# Altium project Sayma_AMC.PrjPcb (part 6 of 18)

## Sheet PWR_DC_DC_EXAR.SchDoc: Sayma AMC
size 420 x 297 mm; $$Internal___BlkDate: 0:12:25_2-9-18; $$Internal_NAME_PLACEHOLDER: a3sheet; $$Internal_Resolution: 00001mm; $$NotCommonProperty_@NAME: PWR_DC_DC_EXAR; $$NotCommonProperty_@PRINTORDER: 2; $$NotCommonProperty_@SHEET: 1; $$NotCommonProperty_@SHEETTOTAL: 1; CmpIndex: 9; Drawing Author: G.Kasprowicz; Drawing Number: Sayma AMC; Drawing Project: AMC FMC Carrier Board; Drawing Revision: 2.0; SymIndex: 2141; CheckedBy: P.Kulik,T.Przywozki,W.Ruclo; Author: G.Kasprowicz; CompanyName: WUT ISE; DrawnBy: G.Kasprowicz; Organization: WUT ISE; Address1: PW ISE; Address2: Nowowiejska 15/19 00-665 Warsaw; Address3: gkasprow@gmail.com; DocumentNumber: 14; Revision: 2; SheetNumber: 14; SheetTotal: 32; ModifiedBy: -; CheckedDate: -; Title2: Exar & 5V supply; DivGrp: WUT ISE; Designer: G.Kasprowicz; ModifiedDate: -; ProjectName: Sensor Box
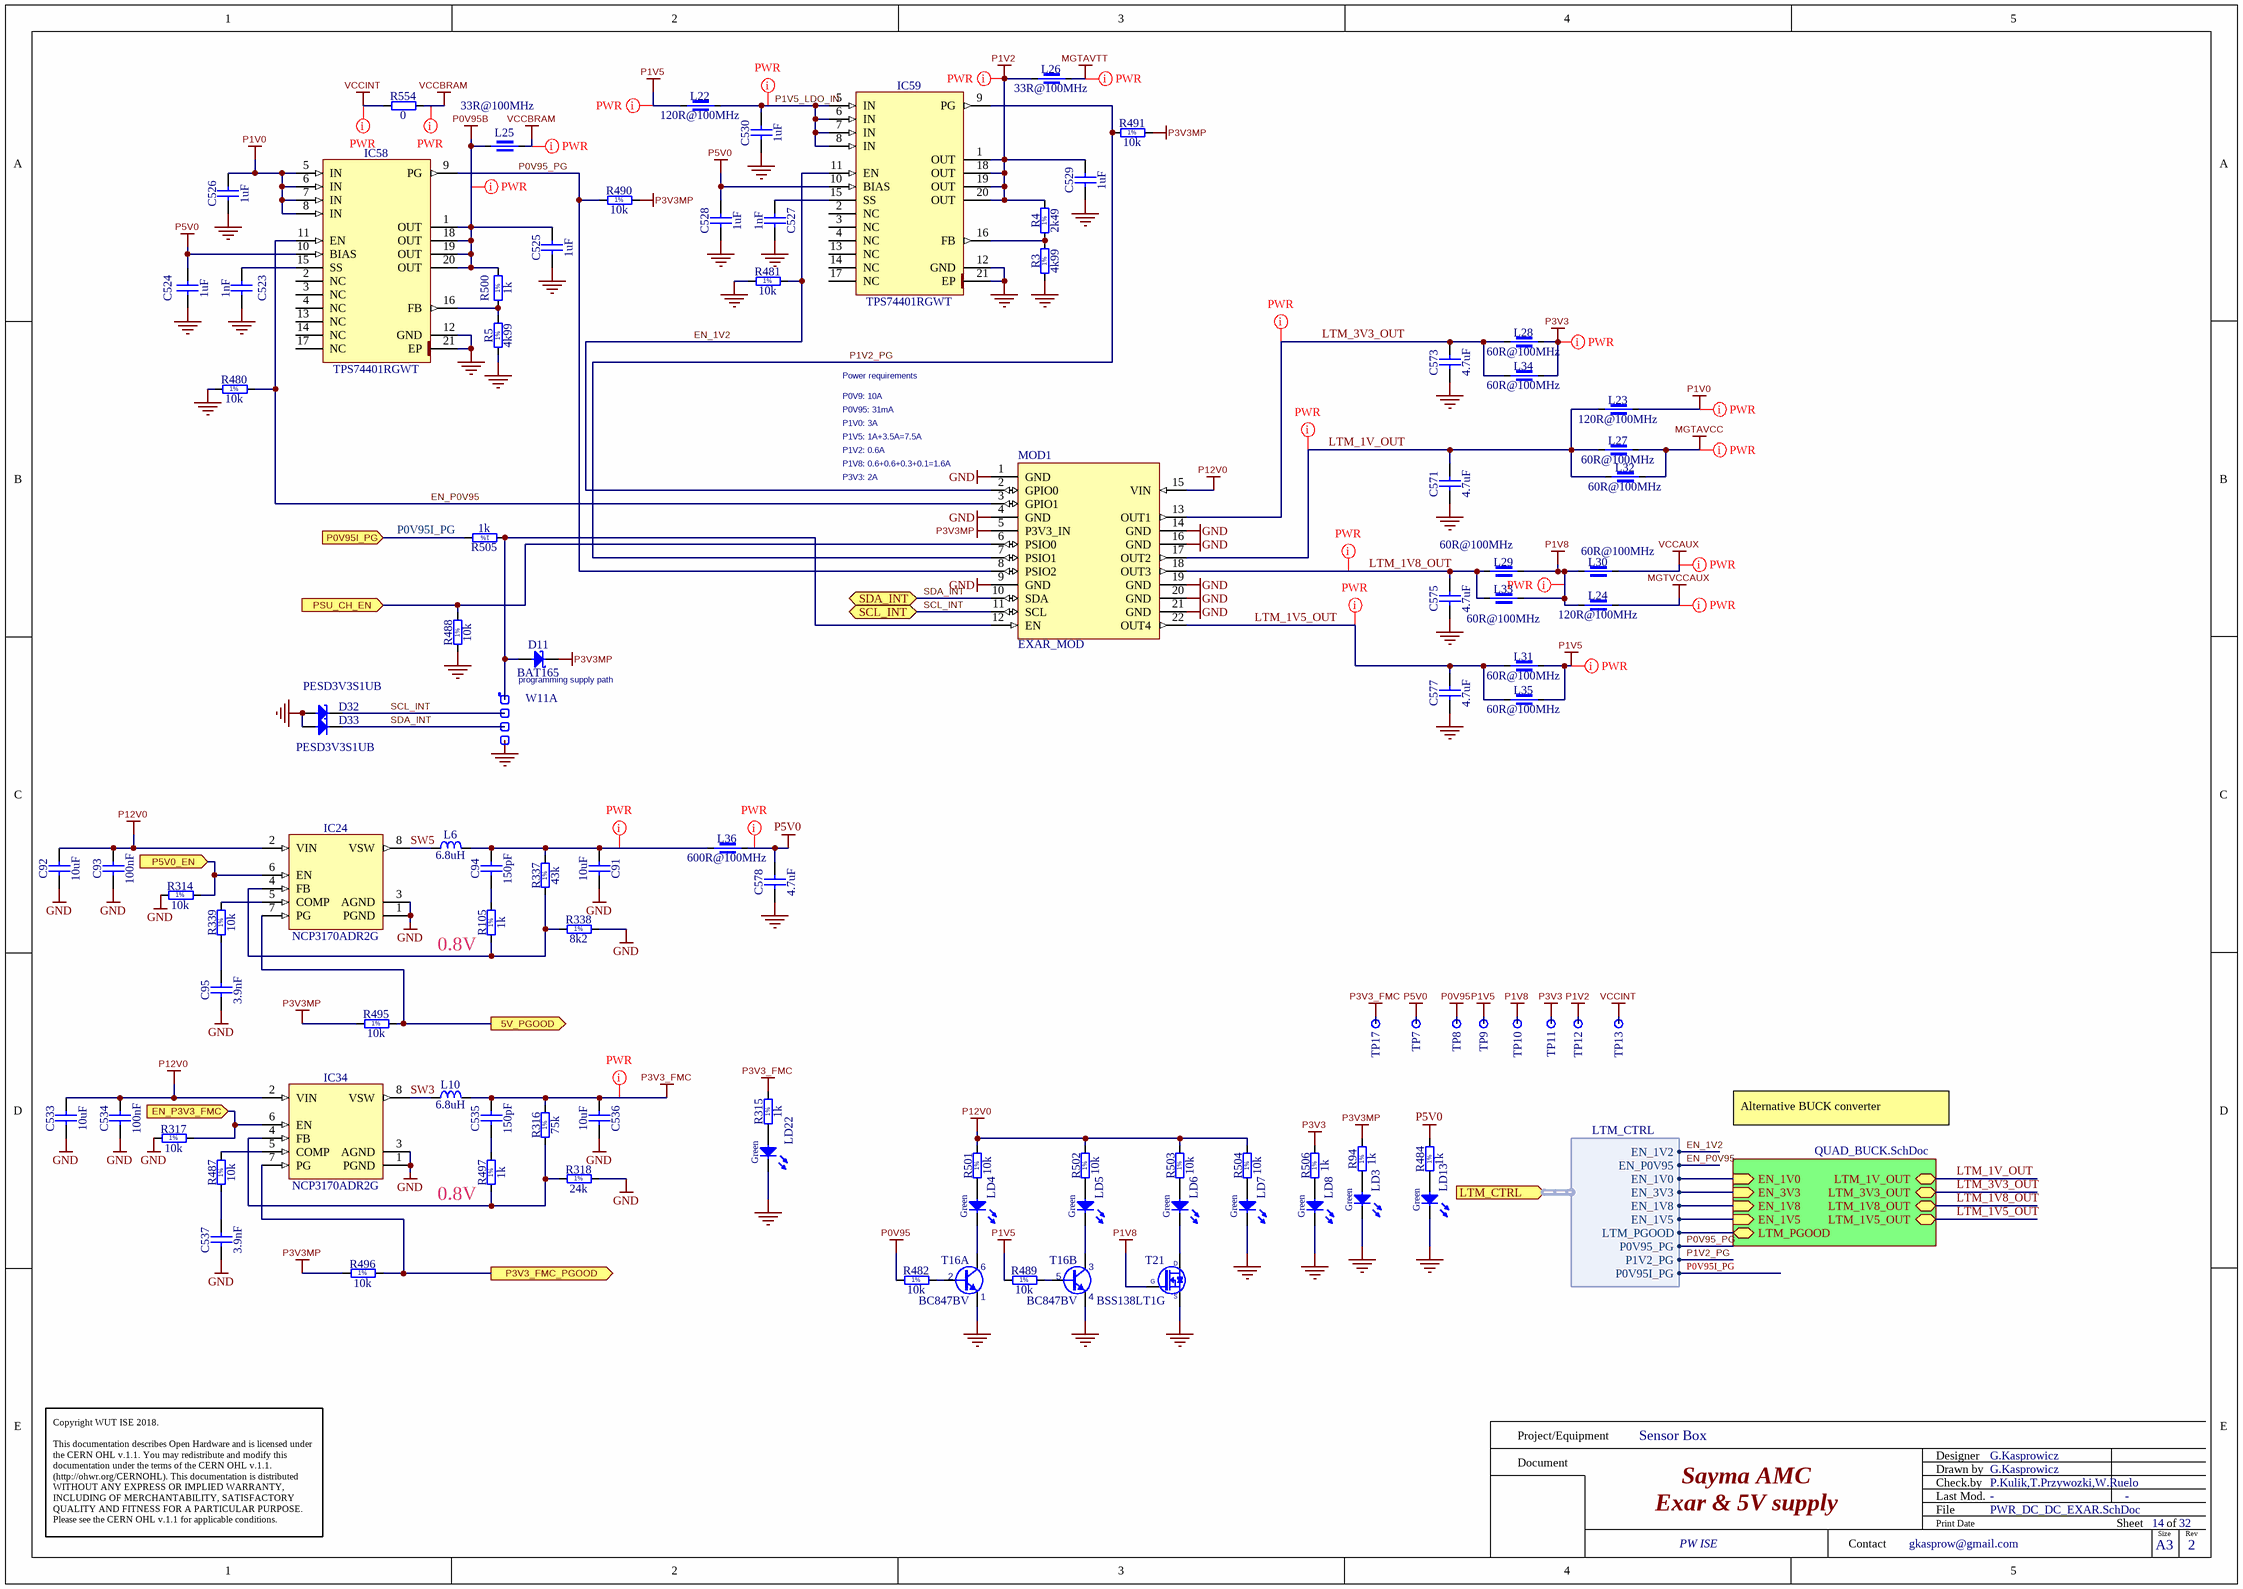
[diagram p8: PWR_DC_DC_EXAR.SchDoc]

### Parts
C91  10uF  [CAPC2012X135N]
C92  10uF  [CAPC2012X135N]
C93  100nF  [CAPC1005X55N]
C94  150pF  [CAPC1608X87N]
C95  3.9nF  [CAPC1608X87N]
C523  1nF  [CAPC1005X55N]
C524  1uF  [CAPC1005X55N]
C525  1uF  [CAPC1005X55N]
C526  1uF  [CAPC1005X55N]
C527  1nF  [CAPC1005X55N]
C528  1uF  [CAPC1005X55N]
C529  1uF  [CAPC1005X55N]
C530  1uF  [CAPC1005X55N]
C533  10uF  [CAPC2012X135N]
C534  100nF  [CAPC1005X55N]
C535  150pF  [CAPC1608X87N]
C536  10uF  [CAPC2012X135N]
C537  3.9nF  [CAPC1608X87N]
C571  4.7uF  [CAPC1709X95N]
C573  4.7uF  [CAPC1709X95N]
C575  4.7uF  [CAPC1709X95N]
C577  4.7uF  [CAPC1709X95N]
C578  4.7uF  [CAPC1709X95N]
D11  BAT165  [SOD2512X110N]
D32  PESD3V3S1UB  [SODFL1608X65N]
D33  PESD3V3S1UB  [SODFL1608X65N]
IC24  NCP3170ADR2G  [SOIC127P600X175-8N]
IC34  NCP3170ADR2G  [SOIC127P600X175-8N]
IC58  TPS74401RGWT  [QFN65P500X500X100-21N-S325]
IC59  TPS74401RGWT  [QFN65P500X500X100-21N-S325]
L6  6.8uH  [IND_BOURNS_SRU8043]
L10  6.8uH  [IND_BOURNS_SRU8043]
L22  120R@100MHz  [INDC1608X95N]
L23  120R@100MHz  [INDC1608X95N]
L24  120R@100MHz  [INDC1608X95N]
L25  33R@100MHz  [INDC1608X95N]
L26  33R@100MHz  [INDC1608X95N]
L27  60R@100MHz  [INDC4516X180N]
L28  60R@100MHz  [INDC4516X180N]
L29  60R@100MHz  [INDC4516X180N]
L30  60R@100MHz  [INDC4516X180N]
L31  60R@100MHz  [INDC4516X180N]
L32  60R@100MHz  [INDC4516X180N]
L33  60R@100MHz  [INDC4516X180N]
L34  60R@100MHz  [INDC4516X180N]
L35  60R@100MHz  [INDC4516X180N]
L36  600R@100MHz  [INDC2012X110N]
LD3  Green  [LED_KINGBRIGHT_KPH-1608CGCK]
LD4  Green  [LED_KINGBRIGHT_KPH-1608CGCK]
LD5  Green  [LED_KINGBRIGHT_KPH-1608CGCK]
LD6  Green  [LED_KINGBRIGHT_KPH-1608CGCK]
LD7  Green  [LED_KINGBRIGHT_KPH-1608CGCK]
LD8  Green  [LED_KINGBRIGHT_KPH-1608CGCK]
LD13  Green  [LED_KINGBRIGHT_KPH-1608CGCK]
LD22  Green  [LED_KINGBRIGHT_KPH-1608CGCK]
MOD1  EXAR_MOD  [EXAR_MOD]
R3  4k99  [RESC1608X55N]
R4  2k49  [RESC1608X55N]
R5  4k99  [RESC1608X55N]
R94  1k  [RESC1005X40N]
R105  1k  [RESC1005X40N]
R314  10k  [RESC1005X40N]
R315  1k  [RESC1005X40N]
R316  75k  [RESC1608X55N]
R317  10k  [RESC1005X40N]
R318  24k  [RESC1608X55N]
R337  43k  [RESC1608X55N]
R338  8k2  [RESC1608X55N]
R339  10k  [RESC1005X40N]
R480  10k  [RESC1005X40N]
R481  10k  [RESC1005X40N]
R482  10k  [RESC1005X40N]
R484  1k  [RESC1005X40N]
R487  10k  [RESC1005X40N]
R488  10k  [RESC1005X40N]
R489  10k  [RESC1005X40N]
R490  10k  [RESC1005X40N]
R491  10k  [RESC1005X40N]
R495  10k  [RESC1005X40N]
R496  10k  [RESC1005X40N]
R497  1k  [RESC1005X40N]
R500  1k  [RESC1005X40N]
R501  10k  [RESC1005X40N]
R502  10k  [RESC1005X40N]
R503  10k  [RESC1005X40N]
R504  10k  [RESC1005X40N]
R505  1k  [RESC1005X40N]
R506  1k  [RESC1005X40N]
R554  0  [RESC2012X60N]
T16  BC847BV  [SOTFL50P160X60-6N]  (parts A,B of 2)
T21  BSS138LT1G  [SOT95P240X110-3N]
TP7  Test Point  [TPS127]  (value not drawn)
TP8  Test Point  [TPS127]  (value not drawn)
TP9  Test Point  [TPS127]  (value not drawn)
TP10  Test Point  [TPS127]  (value not drawn)
TP11  Test Point  [TPS127]  (value not drawn)
TP12  Test Point  [TPS127]  (value not drawn)
TP13  Test Point  [TPS127]  (value not drawn)
TP17  Test Point  [TPS127]  (value not drawn)
W11  Header 4  [SAMTEC_MTLW-104-07-L-S-250]  (value not drawn)  (parts A,B,C,D of 4)

### Sub-sheets
U_QUAD_BUCK = QUAD_BUCK.SchDoc: LTM_1V_OUT (bidir), LTM_1V5_OUT (bidir), EN_1V0 (in), EN_1V5 (in), EN_3V3 (in), EN_1V8 (in), LTM_PGOOD (bidir), LTM_3V3_OUT (bidir), LTM_1V8_OUT (bidir)

### Ports
5V_PGOOD (out), EN_P3V3_FMC (in), LTM_CTRL (in, harness LTM_CTRL), P0V95I_PG (in), P3V3_FMC_PGOOD (out), P5V0_EN (in), PSU_CH_EN (in), SCL_INT (bidir), SDA_INT (bidir)

### Harnesses
LTM_CTRL: EN_1V0, EN_3V3, EN_1V8, EN_1V5, LTM_PGOOD, EN_1V2, EN_P0V95, P0V95_PG, P1V2_PG, P0V95I_PG

### Nets
GND: C91.2 C92.1 C93.1 C95.1 C523.2 C524.1 C525.1 C526.1 C527.2 C528.1 C529.1 C530.1 C533.1 C534.1 C536.2 C537.1 C571.1 C573.1 C575.1 C577.1 C578.1 D32.2(A) D33.2(A) IC24.1(PGND) IC24.3(AGND) IC34.1(PGND) IC34.3(AGND) IC58.12(GND) IC58.21(EP) IC59.12(GND) IC59.21(EP) LD3.1(C) LD7.1(C) LD8.1(C) LD13.1(C) LD22.1(C) MOD1.1(GND) MOD1.4(GND) MOD1.9(GND) MOD1.14(GND) MOD1.16(GND) MOD1.19(GND) MOD1.20(GND) MOD1.21(GND) R3.1 R5.1 R314.1 R317.1 R318.2 R338.2 R480.1 R481.1 R488.1 T16.1(E) T16.4(E) T21.2(S) W11.4
MGTAVCC: L27.2 L32.2
MGTAVTT: L26.2
MGTVCCAUX: L24.1
P0V95: R482.1 TP8.1
P0V95B: C525.2 IC58.1(OUT) IC58.18(OUT) IC58.19(OUT) IC58.20(OUT) L25.1 R500.2
P1V0: C526.2 IC58.5(IN) IC58.6(IN) IC58.7(IN) IC58.8(IN) L23.1
P1V2: C529.2 IC59.1(OUT) IC59.18(OUT) IC59.19(OUT) IC59.20(OUT) L26.1 R4.2 TP12.1
P1V5: L22.2 L31.2 L35.2 R489.1 TP9.1
P1V8: L24.2 L29.2 L30.1 L33.2 T21.1(G) TP10.1
P3V3: L28.2 L34.2 R506.2 TP11.1
P3V3_FMC: C535.2 C536.1 L10.2 R315.2 R316.2 TP17.1
P3V3MP: D11.1(C) MOD1.5(P3V3_IN) R94.2 R490.2 R491.2 R495.1 R496.1
P5V0: C524.2 C528.2 C578.2 IC58.10(BIAS) IC59.10(BIAS) L36.2 R484.2 TP7.1
P12V0: C92.2 C93.2 C533.2 C534.2 IC24.2(VIN) IC34.2(VIN) MOD1.15(VIN) R501.2 R502.2 R503.2 R504.2
VCCAUX: L30.2
VCCBRAM: L25.2 R554.2
VCCINT: R554.1 TP13.1
EN_1V0: sheet U_QUAD_BUCK/EN_1V0, port LTM_CTRL.EN_1V0
EN_1V2: IC59.11(EN) MOD1.2(GPIO0) R481.2 ; port LTM_CTRL.EN_1V2
EN_1V5: sheet U_QUAD_BUCK/EN_1V5, port LTM_CTRL.EN_1V5
EN_1V8: sheet U_QUAD_BUCK/EN_1V8, port LTM_CTRL.EN_1V8
EN_3V3: sheet U_QUAD_BUCK/EN_3V3, port LTM_CTRL.EN_3V3
EN_P0V95: IC58.11(EN) MOD1.3(GPIO1) R480.2 ; port LTM_CTRL.EN_P0V95
EN_P3V3_FMC: IC34.6(EN) R317.2 ; port EN_P3V3_FMC
EN_P5V0: IC24.6(EN) R314.2 ; port P5V0_EN
EN_PSU_CH: MOD1.6(PSIO0) R488.2 ; port PSU_CH_EN
LTM_1V5_OUT: C577.2 L31.1 L35.1 MOD1.22(OUT4) ; sheet U_QUAD_BUCK/LTM_1V5_OUT
LTM_1V8_OUT: C575.2 L29.1 L33.1 MOD1.18(OUT3) ; sheet U_QUAD_BUCK/LTM_1V8_OUT
LTM_1V_OUT: C571.2 L23.2 L27.1 L32.1 MOD1.17(OUT2) ; sheet U_QUAD_BUCK/LTM_1V_OUT
LTM_3V3_OUT: C573.2 L28.1 L34.1 MOD1.13(OUT1) ; sheet U_QUAD_BUCK/LTM_3V3_OUT
LTM_PGOOD: sheet U_QUAD_BUCK/LTM_PGOOD, port LTM_CTRL.LTM_PGOOD
P0V95_PG: IC58.9(PG) MOD1.8(PSIO2) R490.1 ; port LTM_CTRL.P0V95_PG
P0V95I_PG: R505.2 ; port P0V95I_PG, port LTM_CTRL.P0V95I_PG
P1V2_PG: IC59.9(PG) MOD1.7(PSIO1) R491.1 ; port LTM_CTRL.P1V2_PG
P1V5_LDO_IN: C530.2 IC59.5(IN) IC59.6(IN) IC59.7(IN) IC59.8(IN) L22.1
P3V3_FMC_PGOOD: IC34.7(PG) R496.2 ; port P3V3_FMC_PGOOD
PGOOD_P5V0: IC24.7(PG) R495.2 ; port 5V_PGOOD
SCL_INT: D32.1(C) MOD1.11(SCL) W11.2 ; port SCL_INT  [project net PM_SCL]
SDA_INT: D33.1(C) MOD1.10(SDA) W11.3 ; port SDA_INT  [project net PM_SDA]
SW3: IC34.8(VSW) L10.1
SW5: IC24.8(VSW) L6.1
NetC91_1: C91.1 C94.2 L6.2 L36.1 R337.2
NetC94_1: C94.1 R105.2
NetC95_2: C95.2 R339.1
NetC523_1: C523.1 IC58.15(SS)
NetC527_1: C527.1 IC59.15(SS)
NetC535_1: C535.1 R497.2
NetC537_2: C537.2 R487.1
NetD11_2: D11.2(A) MOD1.12(EN) R505.1 W11.1
NetIC24_4: IC24.4(FB) R105.1 R337.1 R338.1
NetIC24_5: IC24.5(COMP) R339.2
NetIC34_4: IC34.4(FB) R316.1 R318.1 R497.1
NetIC34_5: IC34.5(COMP) R487.2
NetIC58_16: IC58.16(FB) R5.2 R500.1
NetIC59_16: IC59.16(FB) R3.2 R4.1
NetLD3_2: LD3.2(A) R94.1
NetLD4_1: LD4.1(C) T16.6(C)
NetLD4_2: LD4.2(A) R501.1
NetLD5_1: LD5.1(C) T16.3(C)
NetLD5_2: LD5.2(A) R502.1
NetLD6_1: LD6.1(C) T21.3(D)
NetLD6_2: LD6.2(A) R503.1
NetLD7_2: LD7.2(A) R504.1
NetLD8_2: LD8.2(A) R506.1
NetLD13_2: LD13.2(A) R484.1
NetLD22_2: LD22.2(A) R315.1
NetR482_2: R482.2 T16.2(B)
NetR489_2: R489.2 T16.5(B)

Not connected (* = marked no-connect by the designer): IC58 2(NC) 3(NC) 4(NC) 13(NC) 14(NC) 17(NC); IC59 2(NC) 3(NC) 4(NC) 13(NC) 14(NC) 17(NC)

### Layout directives
net class PWR: LTM_1V5_OUT, LTM_1V8_OUT, LTM_1V_OUT, LTM_3V3_OUT, MGTAVCC, MGTAVTT, MGTVCCAUX, NetC91_1, P0V95B, P1V0, P1V2, P1V5, P1V5_LDO_IN, P1V8, P3V3, P3V3_FMC, P5V0, VCCAUX, VCCBRAM, VCCINT

### Notes on the sheet
- Power requirements
- P0V9: 10A
- P1V0: 3A
- P0V95: 31mA
- P1V5: 1A+3.5A=7.5A
- P1V2: 0.6A
- P3V3: 2A
- P1V8: 0.6+0.6+0.3+0.1=1.6A
- programming supply path
- (near R105) 0.8V
- Alternative BUCK converter
- (near R497) 0.8V
- Project/Equipment
- Document
- Designer
- Drawn by
- Check.by
- Copyright WUT ISE 2018.
  This documentation describes Open Hardware and is licensed under the CERN OHL v.1.1. You may redistribute and modify this documentation under the terms of the CERN OHL v.1.1. (http://ohwr.org/CERNOHL). This documentation is distributed WITHOUT ANY EXPRESS OR IMPLIED WARRANTY, INCLUDING OF MERCHANTABILITY, SATISFACTORY QUALITY AND FITNESS FOR A PARTICULAR PURPOSE. Please see the CERN OHL v.1.1 for applicable conditions.
- Contact
- File
- Last Mod.
- Print Date
- Sheet
- Size
- A3
- of
- Rev
- (in symbol R0402_1K_1%_0.0625W_100PPM) 1%
- (in symbol R0402_10K_1%_0.0625W_100PPM) 1%
- (in symbol R0603_2K49_1%_0.063W_50PPM) 1%
- (in symbol R0603_4K99_1%_0.063W_50PPM) 1%
- (in symbol R0603_8K2_1%_0.1W_100PPM) 1%
- (in symbol R0603_24k_1%_0.1W_100PPM) 1%
- (in symbol R0603_43K_1%_0.1W_100PPM) 1%
- (in symbol R0603_75K_1%_0.1W_100PPM) 1%

### Library data of the parts
C91 C92 C533 C536 = CC0805_10UF_16V_10%_X5R: Non-polarised capacitor; Part Description: SMD Multilayer Chip Ceramic Capacitor; Manufacturer: GENERIC; Manufacturer1 Part Number: C0805C106K4PAC; Voltage: 16V; TC: X5R; Tolerance: ±10%; Part Number: CC0805_10UF_16V_10%_X5R; Component Kind: Standard; Component Type: Standard; Pin Count: 2; Value: 10uF; Status: Preferred; Manufacturer Part Number: CC0805_10UF_16V_10%_X5R; Case: 0805; Mounted: Yes; Socket: No; SMD: Yes; Manufacturer1 Example: KEMET; Manufacturer1 ComponentHeight: 1.4mm; HelpURL: \\cern.ch\dfs\Applications\Altium\Datasheets\CC1206_X5R_KEMET.pdf; Author: CERN DEM JLC; CreateDate: 03.12.2007; LatestRevisionDate: 03.12.2007; Sense: No
C93 C534 = CC0402_100NF_16V_10%_X5R: Non-polarised capacitor; Part Description: SMD Multilayer Chip Ceramic Capacitor; Manufacturer: GENERIC; Manufacturer1 Part Number: GRM155R61C104KA88D; Voltage: 16V; TC: X5R; Tolerance: ±10%; Part Number: CC0402_100NF_16V_10%_X5R; Component Kind: Standard; Component Type: Standard; Pin Count: 2; Value: 100nF; Status: None; Manufacturer Part Number: CC0402_100NF_16V_10%_X5R; Case: 0402; Mounted: Yes; Socket: No; SMD: Yes; Sense: No; Manufacturer1 Example: MURATA; Manufacturer1 ComponentHeight: 0.55mm; HelpURL: \\cern.ch\dfs\Applications\Altium\Datasheets\CC0402_X5R_MURATA_GRM.pdf; Author: CERN DEM JLC; CreateDate: 10.12.2013; LatestRevisionDate: 10.12.2013
C94 C535 = CC0603_150PF_50V_1%_NP0: Non-polarised capacitor; Part Description: SMD Multilayer Chip Ceramic Capacitor; Manufacturer: GENERIC; Manufacturer1 Part Number: CC0603FRNPO9BN151; Voltage: 50V; TC: C0G/NP0; Tolerance: ±1%; Part Number: CC0603_150PF_50V_1%_NP0; Component Kind: Standard; Component Type: Standard; Pin Count: 2; Value: 150pF; Status: None; Manufacturer Part Number: CC0603_150PF_50V_1%_NP0; Case: 0603; Mounted: Yes; Socket: No; SMD: Yes; Sense: No; Manufacturer1 Example: PHYCOMP; Manufacturer1 ComponentHeight: 0.7mm; HelpURL: \\cern.ch\dfs\Applications\Altium\Datasheets\CC0805_NP0_PHYCOMP_16VTO50V.pdf; Author: CERN DEM MR; CreateDate: 17.02.2016; LatestRevisionDate: 17.02.2016
C95 C537 = CC0603_3.9NF_50V_5%_X7R: Non-polarised capacitor; Part Description: SMD Multilayer Chip Ceramic Capacitor; Manufacturer: GENERIC; Manufacturer1 Part Number: 223858615631; Voltage: 50V; TC: X7R; Tolerance: ±5%; Part Number: CC0603_3.9NF_50V_5%_X7R; Component Kind: Standard; Component Type: Standard; Pin Count: 2; Value: 3.9nF; Status: Preferred; Manufacturer Part Number: CC0603_3.9NF_50V_5%_X7R; Case: 0603; Mounted: Yes; Socket: No; SMD: Yes; Sense: No; Manufacturer1 Example: PHYCOMP; Manufacturer1 ComponentHeight: 0.87mm; HelpURL: \\cern.ch\dfs\Applications\Altium\Datasheets\CC0603_X7R_PHYCOMP.pdf; Author: CERN DEM JLC; CreateDate: 03.12.2007; LatestRevisionDate: 03.12.2007
C523 C527 = CC0402_1NF_50V_10%_X7R: Non-polarised capacitor; Manufacturer: GENERIC; Part Description: SMD Multilayer Chip Ceramic Capacitor; Manufacturer1 Part Number: 223858715623; Tolerance: ±10%; Voltage: 50V; TC: X7R; Manufacturer Part Number: CC0402_1NF_50V_10%_X7R; Part Number: CC0402_1NF_50V_10%_X7R; Value: 1nF; Component Kind: Standard; Component Type: Standard; Pin Count: 2; Status: Not Recommended; Case: 0402; Mounted: Yes; Socket: No; SMD: Yes; Sense: No; Manufacturer1 Example: PHYCOMP; Manufacturer1 ComponentHeight: 0.55mm; HelpURL: \\cern.ch\dfs\Applications\Altium\Datasheets\CC0402_X7R_PHYCOMP.pdf; Author: CERN DEM JLC; CreateDate: 03.12.2007; LatestRevisionDate: 03.12.2007
C524-C526 C528-C530 = CC0402_1UF_16V_10%_X5R: as C439-C445 on sheet SDRAM_DDR3_2x16; Manufacturer Part Number: CC0402_1UF_16V_10%_X5R; Part Number: CC0402_1UF_16V_10%_X5R; Value: 1uF; Component Kind: Standard; Component Type: Standard; Pin Count: 2; Status: Preferred; Case: 0402; Mounted: Yes; Socket: No; SMD: Yes; Sense: No; Manufacturer1 Example: TDK; Manufacturer1 ComponentHeight: 0.55mm; HelpURL: \\cern.ch\dfs\Applications\Altium\Datasheets\CC0402_X5R_TDK_C.pdf; Author: CERN DEM JLC; CreateDate: 25.10.2012; LatestRevisionDate: 25.10.2012
C571 C573 C575 C577 C578 = CC0603_4.7UF_16V_10%_X5R: as C564 on sheet POWER_Management; Manufacturer Part Number: CC0603_4.7UF_16V_10%_X5R; Part Number: CC0603_4.7UF_16V_10%_X5R; Value: 4.7uF; Component Kind: Standard; Component Type: Standard; Pin Count: 2; Status: None; Case: 0603; Mounted: Yes; Socket: No; SMD: Yes; Sense: No; Manufacturer1 Example: TAIYO YUDEN; Manufacturer1 ComponentHeight: 0.95mm; HelpURL: \\cern.ch\dfs\Applications\Altium\Datasheets\CC0603_X7R_TAIYO-YUDEN_HIGH-VALUE.pdf; Author: CERN DEM JLC; CreateDate: 16.12.2013; LatestRevisionDate: 16.09.2014
D11 = BAT165: as D8 on sheet POWER_Management; Manufacturer Part Number: BAT165; PackageDescription: Small Outline Diode (SOD-323), 1.70mm W X 1.25mm L X 1.10mm H body,  IPC Medium Density; Part Number: BAT165; Component Kind: Standard; Component Type: Standard; Device: BAT165; Pin Count: 2; Case: SOD323; Mounted: Yes; Socket: No; SMD: Yes; Sense: No; ComponentHeight: 1.1mm; HelpURL: \\cern.ch\dfs\Applications\Altium\Datasheets\BAT165.pdf; Author: CERN DEM JLC; CreateDate: 12.11.2014; LatestRevisionDate: 12.11.2014
D32 D33 = PESD3V3S1UB: ESD protection diode; Manufacturer: NXP SEMICONDUCTORS; Part Description: ESD protection diode (23kV); Voltage: 3V3; Power: 330W; PressFit: No; Bonding: No; Manufacturer Part Number: PESD3V3S1UB; PackageDescription: Ultra Small Outline Diode Flat Lead (SOD-523), Body; 1.2mm L X 0.8mm W X 0.65mm H, IPC Medium Density; Part Number: PESD3V3S1UB; Component Kind: Standard; Component Type: Standard; Device: PESD3V3S1UB; Pin Count: 2; Case: SOD523; Mounted: Yes; Socket: No; SMD: Yes; Sense: No; ComponentHeight: 0.65mm; HelpURL: \\cern.ch\dfs\Applications\Altium\Datasheets\PESD3V3S1UB.pdf; Author: CERN DEM JLC; CreateDate: 29.11.2012; LatestRevisionDate: 29.11.2012
IC24 IC34 = NCP3170ADR2G: Synchronous PWM Switching Converter; Manufacturer: ON SEMICONDUCTOR; PressFit: No; Bonding: No; Part Number: NCP3170ADR2G; Component Kind: Standard; Component Type: Standard; Device: NCP3170ADR2G; PackageDescription: SOIC 8, Pitch 1.27mm - Body 4x5mm, IPC Medium Density; Part Description: Synchronous PWM Switching Converter; Manufacturer Part Number: NCP3170ADR2G; Pin Count: 8; Case: SOIC8; Mounted: Yes; Socket: No; SMD: Yes; Sense: No; ComponentHeight: 1.75mm; Author: CERN DEM MR; HelpURL: \\cern.ch\dfs\Applications\Altium\Datasheets\NCP3170ADR2G.pdf; CreateDate: 30.05.2016; LatestRevisionDate: 30.05.2016
IC58 IC59 = TPS74401RGWT: Single Output LDO, 3.0A, Adj.(0.8 to 3.3V), Fast Transient Response, Programmable SoftStart; Manufacturer: TEXAS INSTRUMENTS; PressFit: No; Bonding: No; Manufacturer Part Number: TPS74401RGWT; PackageDescription: QFN, 0.65mm pitch,square; 20 pin, 5mm X 5mm X 1mm H body (w/thermal tab 3.25 X 3.25mm),  IPC Medium Density; Part Description: Single Output LDO, 3.0A, Adj.(0.8 to 3.3V), Fast Transient Response, Programmable SoftStart; Part Number: TPS74401RGWT; Component Kind: Standard; Component Type: Standard; Device: TPS74401RGWT; Pin Count: 21; Case: QFN20; Mounted: Yes; Socket: No; SMD: Yes; Sense: No; ComponentHeight: 1mm; HelpURL: \\cern.ch\dfs\Applications\Altium\Datasheets\TPS74401RGWT.pdf; Author: CERN DEM JLC; CreateDate: 02.02.2010; LatestRevisionDate: 02.02.2010
L6 L10 = IND_6.8UH_30%_BOURNS_SRU8043: Inductor; Part Description: Shielded SMD Power Inductor; Manufacturer: BOURNS; Manufacturer Part Number: SRU8043-6R8Y; Power: 3.8A; Resistance: 0.0224R; Tolerance: ±30%; Part Number: IND_6.8UH_30%_BOURNS_SRU8043; Component Kind: Standard; Component Type: Standard; Pin Count: 2; Value: 6.8uH; Status: None; Mounted: Yes; Socket: No; SMD: Yes; Sense: No; ComponentHeight: 4.6mm; HelpURL: \\cern.ch\dfs\Applications\Altium\Datasheets\IND_BOURNS_SRU8043.pdf; Author: CERN DEM JMW; CreateDate: 06.08.2015; LatestRevisionDate: 06.08.2015
L22-L24 = IND0603_MURATA_BLM18PG121SN1D: Manufacturer: MURATA; Part Description: SMD EMIFIL Chip Ferrite Bead; Power: 2A; Resistance: 0.05R; Manufacturer Part Number: BLM18PG121SN1D; Part Number: IND0603_MURATA_BLM18PG121SN1D; Value: 120R@100MHz; Component Kind: Standard; Component Type: Standard; Pin Count: 2; Status: None; Case: 0603; Mounted: Yes; Socket: No; SMD: Yes; Sense: No; ComponentHeight: 0.95mm; HelpURL: \\cern.ch\dfs\Applications\Altium\Datasheets\IND0603_MURATA_BLM18P.pdf; Author: CERN DEM BC; CreateDate: 27.07.2015; LatestRevisionDate: 25.10.2018
L25 L26 = IND0603_MURATA_BLM18PG330SN1D: Manufacturer: MURATA; Part Description: SMD EMIFIL Chip Ferrite Bead; Tolerance: ±25%; Power: 3A; Resistance: 0.025R; Manufacturer Part Number: BLM18PG330SN1D; Part Number: IND0603_MURATA_BLM18PG330SN1D; Value: 33R@100MHz; Component Kind: Standard; Component Type: Standard; Pin Count: 2; Status: None; Case: 0603; Mounted: Yes; Socket: No; SMD: Yes; Sense: No; ComponentHeight: 0.95mm; HelpURL: \\cern.ch\dfs\Applications\Altium\Datasheets\IND0603_MURATA_BLM18P.pdf; Author: CERN DEM JMW; CreateDate: 19.02.2014; LatestRevisionDate: 25.10.2018
L27-L35 = IND1806_MURATA_BLM41PG600SN1L: Manufacturer: MURATA; Part Description: SMD EMI Suppression Chip Ferrite Bead (BLM41P Series); Power: 6A; Resistance: 0.01R; Manufacturer Part Number: BLM41PG600SN1L; Part Number: IND1806_MURATA_BLM41PG600SN1L; Value: 60R@100MHz; Component Kind: Standard; Component Type: Standard; Pin Count: 2; Status: None; Case: 1806; Mounted: Yes; Socket: No; SMD: Yes; Sense: No; ComponentHeight: 1.8mm; HelpURL: \\cern.ch\dfs\Applications\Altium\Datasheets\IND1806_MURATA_BLM41P.pdf; Author: CERN DEM JLC; CreateDate: 02.12.2009; LatestRevisionDate: 02.12.2009
L36 = IND0805_WURTH_742792040: Manufacturer: WURTH ELEKTRONIK; Part Description: SMD EMI Suppression Chip Ferrite Bead (WE-CBF Series); Tolerance: ±25%; Power: 2A; Resistance: 0.150R; Manufacturer Part Number: 742792040; Part Number: IND0805_WURTH_742792040; Value: 600R@100MHz; Component Kind: Standard; Component Type: Standard; Pin Count: 2; Status: None; Case: 0805; Mounted: Yes; Socket: No; SMD: Yes; Sense: No; ComponentHeight: 1.1mm; HelpURL: \\cern.ch\dfs\Applications\Altium\Datasheets\IND0805_WURTH_742792040.pdf; Author: CERN DEM JLC; CreateDate: 10.05.2010; LatestRevisionDate: 25.10.2018
LD3-LD8 LD13 LD22 = LED_KINGBRIGHT_KPH-1608CGCK: as LD1 on sheet POWER_Management; Manufacturer Part Number: KPH-1608CGCK; Manufacturer: KINGBRIGHT; PackageDescription: SMT Green LED, Case 0603, Body L 1.6 x W 0.8mm H 0.65mm; Part Number: LED_KINGBRIGHT_KPH-1608CGCK; Component Kind: Standard; Component Type: Standard; Color: Green; Pin Count: 2; Mounted: Yes; Socket: No; SMD: Yes; Sense: No; ComponentHeight: 0.65mm; HelpURL: \\cern.ch\dfs\Applications\Altium\Datasheets\LED_KINGBRIGHT_KPH-1608CGCK.pdf; Author: CERN DEM JLC; CreateDate: 03.07.2017; LatestRevisionDate: 03.07.2017
MOD1 = DC/DC_EXAR_MOD: 4 channel PCB module based on XRP7724ILB-F
R3 R5 = R0603_4K99_1%_0.063W_50PPM: Resistor - 1%; Manufacturer: GENERIC; Part Description: General Purpose Thick Film Chip Resistor; Manufacturer1 Part Number: CPF0603F4K99C1; Power: 0.1W; TC: ±50ppm/°C; PressFit: No; Manufacturer Part Number: R0603_4K99_1%_0.063W_50PPM; Part Number: R0603_4K99_1%_0.063W_50PPM; Tolerance: ±1%; Value: 4k99; Component Kind: Standard; Component Type: Standard; Pin Count: 2; Status: None; Case: 0603; Mounted: Yes; Sense: No; Socket: No; SMD: Yes; Manufacturer1 Example: TYCO NEOHM; Manufacturer1 ComponentHeight: 0.55mm; HelpURL: \\cern.ch\dfs\Applications\Altium\Datasheets\R0603_TYCO_CPF.pdf; Author: CERN DEM JLC; CreateDate: 20.05.2010; LatestRevisionDate: 20.05.2010
R4 = R0603_2K49_1%_0.063W_50PPM: Resistor - 1%; Manufacturer: GENERIC; Part Description: General Purpose Thick Film Chip Resistor; Manufacturer1 Part Number: CPF0603F2K49C1; Power: 0.1W; TC: ±50ppm/°C; PressFit: No; Manufacturer Part Number: R0603_2K49_1%_0.063W_50PPM; Part Number: R0603_2K49_1%_0.063W_50PPM; Tolerance: ±1%; Value: 2k49; Component Kind: Standard; Component Type: Standard; Pin Count: 2; Status: None; Case: 0603; Mounted: Yes; Sense: No; Socket: No; SMD: Yes; Manufacturer1 Example: TYCO NEOHM; Manufacturer1 ComponentHeight: 0.55mm; HelpURL: \\cern.ch\dfs\Applications\Altium\Datasheets\R0603_TYCO_CPF.pdf; Author: CERN DEM JLC; CreateDate: 20.05.2010; LatestRevisionDate: 20.05.2010
R94 R315 R484 R500 R505 R506 = R0402_1K_1%_0.0625W_100PPM: as R83 on sheet POWER_Management; Manufacturer Part Number: R0402_1K_1%_0.0625W_100PPM; Part Number: R0402_1K_1%_0.0625W_100PPM; Tolerance: ±1%; Value: 1k; Component Kind: Standard; Component Type: Standard; Pin Count: 2; Status: Not Recommended; Power: 0.0625W; Case: 0402; Mounted: Yes; Sense: No; Socket: No; SMD: Yes; Manufacturer1 Example: YAGEO PHYCOMP; Manufacturer1 ComponentHeight: 0.4mm; HelpURL: \\cern.ch\dfs\Applications\Altium\Datasheets\R0402_Phycomp_RC0402.pdf; Author: CERN DEM JLC; CreateDate: 03.12.2007; LatestRevisionDate: 17.10.2012
R105 R497 = R0402_1K_1%_0.0625W_100PPM: Resistor - 1%; Part Description: General Purpose Thick Film Chip Resistor; Manufacturer: GENERIC; Manufacturer1 Part Number: 232270671002L; TC: ±100ppm/°C; PressFit: No; Part Number: R0402_1K_1%_0.0625W_100PPM; Component Kind: Standard; Component Type: Standard; Pin Count: 2; Value: 1k; Status: Not Recommended; Power: 0.0625W; Tolerance: ±1%; Manufacturer Part Number: R0402_1K_1%_0.0625W_100PPM; Case: 0402; Mounted: Yes; Sense: No; Socket: No; SMD: Yes; Manufacturer1 Example: YAGEO PHYCOMP; Manufacturer1 ComponentHeight: 0.4mm; HelpURL: \\cern.ch\dfs\Applications\Altium\Datasheets\R0402_Phycomp_RC0402.pdf; Author: CERN DEM JLC; CreateDate: 03.12.2007; LatestRevisionDate: 17.10.2012
R314 R317 R480-R482 R488-R491 R495 R496 R501-R504 = R0402_10K_1%_0.0625W_100PPM: as R139 on sheet SDRAM_DDR3_2x16; Manufacturer Part Number: R0402_10K_1%_0.0625W_100PPM; Part Number: R0402_10K_1%_0.0625W_100PPM; Tolerance: ±1%; Value: 10k; Component Kind: Standard; Component Type: Standard; Pin Count: 2; Status: Not Recommended; Power: 0.0625W; Case: 0402; Mounted: Yes; Sense: No; Socket: No; SMD: Yes; Manufacturer1 Example: YAGEO PHYCOMP; Manufacturer1 ComponentHeight: 0.4mm; HelpURL: \\cern.ch\dfs\Applications\Altium\Datasheets\R0402_Phycomp_RC0402.pdf; Author: CERN DEM JLC; CreateDate: 03.12.2007; LatestRevisionDate: 17.10.2012
R316 = R0603_75K_1%_0.1W_100PPM: Resistor - 1%; Part Description: General Purpose Thick Film Chip Resistor; Manufacturer: GENERIC; Manufacturer1 Part Number: NRC06F7502TRF; Power: 0.1W; TC: ±100ppm/°C; PressFit: No; Part Number: R0603_75K_1%_0.1W_100PPM; Component Kind: Standard; Component Type: Standard; Pin Count: 2; Value: 75k; Status: Preferred; Tolerance: ±1%; Manufacturer Part Number: R0603_75K_1%_0.1W_100PPM; Case: 0603; Mounted: Yes; Sense: No; Socket: No; SMD: Yes; Manufacturer1 Example: NIC COMPONENT; Manufacturer1 ComponentHeight: 0.55mm; HelpURL: \\cern.ch\dfs\Applications\Altium\Datasheets\R0603_NIC_NRC.pdf; Author: CERN DEM JLC; CreateDate: 03.12.2007; LatestRevisionDate: 13.03.2008
R318 = R0603_24k_1%_0.1W_100PPM: Resistor - 1%; Part Description: General Purpose Thick Film Chip Resistor; Manufacturer: GENERIC; Manufacturer1 Part Number: NRC06F2402TRF; Power: 0.1W; TC: ±100ppm/°C; PressFit: No; Part Number: R0603_24K_1%_0.1W_100PPM; Component Kind: Standard; Component Type: Standard; Pin Count: 2; Value: 24k; Status: Preferred; Tolerance: ±1%; Manufacturer Part Number: R0603_24K_1%_0.1W_100PPM; Case: 0603; Mounted: Yes; Sense: No; Socket: No; SMD: Yes; Manufacturer1 Example: NIC COMPONENT; Manufacturer1 ComponentHeight: 0.55mm; HelpURL: \\cern.ch\dfs\Applications\Altium\Datasheets\R0603_NIC_NRC.pdf; Author: CERN DEM JLC; CreateDate: 03.12.2007; LatestRevisionDate: 13.03.2008
R337 = R0603_43K_1%_0.1W_100PPM: Resistor - 1%; Part Description: General Purpose Thick Film Chip Resistor; Manufacturer: GENERIC; Manufacturer1 Part Number: NRC06F4302TRF; Power: 0.1W; TC: ±100ppm/°C; PressFit: No; Part Number: R0603_43K_1%_0.1W_100PPM; Component Kind: Standard; Component Type: Standard; Pin Count: 2; Value: 43k; Status: Preferred; Tolerance: ±1%; Manufacturer Part Number: R0603_43K_1%_0.1W_100PPM; Case: 0603; Mounted: Yes; Sense: No; Socket: No; SMD: Yes; Manufacturer1 Example: NIC COMPONENT; Manufacturer1 ComponentHeight: 0.55mm; HelpURL: \\cern.ch\dfs\Applications\Altium\Datasheets\R0603_NIC_NRC.pdf; Author: CERN DEM JLC; CreateDate: 03.12.2007; LatestRevisionDate: 13.03.2008
R338 = R0603_8K2_1%_0.1W_100PPM: Resistor - 1%; Part Description: General Purpose Thick Film Chip Resistor; Manufacturer: GENERIC; Manufacturer1 Part Number: NRC06F8201TRF; Power: 0.1W; TC: ±100ppm/°C; PressFit: No; Part Number: R0603_8K2_1%_0.1W_100PPM; Component Kind: Standard; Component Type: Standard; Pin Count: 2; Value: 8k2; Status: Preferred; Tolerance: ±1%; Manufacturer Part Number: R0603_8K2_1%_0.1W_100PPM; Case: 0603; Mounted: Yes; Sense: No; Socket: No; SMD: Yes; Manufacturer1 Example: NIC COMPONENT; Manufacturer1 ComponentHeight: 0.55mm; HelpURL: \\cern.ch\dfs\Applications\Altium\Datasheets\R0603_NIC_NRC.pdf; Author: CERN DEM JLC; CreateDate: 03.12.2007; LatestRevisionDate: 13.03.2008
R339 R487 = R0402_10K_1%_0.0625W_100PPM: Resistor - 1%; Part Description: General Purpose Thick Film Chip Resistor; Manufacturer: GENERIC; Manufacturer1 Part Number: 232270671003L; TC: ±100ppm/°C; PressFit: No; Part Number: R0402_10K_1%_0.0625W_100PPM; Component Kind: Standard; Component Type: Standard; Pin Count: 2; Value: 10k; Status: Not Recommended; Power: 0.0625W; Tolerance: ±1%; Manufacturer Part Number: R0402_10K_1%_0.0625W_100PPM; Case: 0402; Mounted: Yes; Sense: No; Socket: No; SMD: Yes; Manufacturer1 Example: YAGEO PHYCOMP; Manufacturer1 ComponentHeight: 0.4mm; HelpURL: \\cern.ch\dfs\Applications\Altium\Datasheets\R0402_Phycomp_RC0402.pdf; Author: CERN DEM JLC; CreateDate: 03.12.2007; LatestRevisionDate: 17.10.2012
R554 = R0805_0R_JUMPER: Resistor; Part Description: 2A (0.05R Max DC Resistance) Zero Ohm Jumper; Manufacturer: GENERIC; Manufacturer1 Part Number: NRC10Z0; PressFit: No; Part Number: R0805_0R_JUMPER; Component Kind: Standard; Component Type: Standard; Pin Count: 2; Value: 0; Status: Preferred; Manufacturer Part Number: R0805_0R_JUMPER; Case: 0805; Mounted: Yes; Sense: No; Socket: No; SMD: Yes; Manufacturer1 Example: NIC COMPONENT; Manufacturer1 ComponentHeight: 0.6mm; HelpURL: \\cern.ch\dfs\Applications\Altium\Datasheets\R0805_NIC_NRC.pdf; Author: CERN DEM JLC; CreateDate: 03.12.2007; LatestRevisionDate: 13.03.2008
T16 = BC847BV: 45V, 100mA NPN General Purpose Double Transistor; Manufacturer: NXP SEMICONDUCTORS; Part Description: 45V 100mA NPN General Purpose Double Transistor; PressFit: No; Bonding: No; Manufacturer Part Number: BC847BV; PackageDescription: SOTFL (SOT666), 0.50mm, Pitch; 6 Pin, 1.20mm W X 1.60mm L X 0.60mm H Body, IPC Medium Density; Part Number: BC847BV; Component Kind: Standard; Component Type: Standard; Device: BC847BV; Pin Count: 6; Case: SOT666; Mounted: Yes; Socket: No; SMD: Yes; Sense: No; ComponentHeight: 0.6mm; HelpURL: \\cern.ch\dfs\Applications\Altium\Datasheets\BC847BV.pdf; Author: CERN DEM JLC; CreateDate: 01.12.2011; LatestRevisionDate: 01.12.2011
T21 = BSS138LT1G: as T13-T15 on sheet POWER_Management; Manufacturer Part Number: BSS138LT1G; PackageDescription: SOT23 3-Leads, Pitch 0.95mm - Body 1.4x3mm, IPC Medium Density; Part Number: BSS138LT1G; Component Kind: Standard; Component Type: Standard; Device: BSS138LT1G; Pin Count: 3; Case: SOT23-3; Mounted: Yes; Socket: No; SMD: Yes; Sense: No; ComponentHeight: 1.11mm; HelpURL: \\cern.ch\dfs\Applications\Altium\Datasheets\BSS138LT1G.pdf; Author: CERN DEM JLC; CreateDate: 23.03.2009; LatestRevisionDate: 23.03.2009
TP7-TP13 TP17 = SMD_PAD_1.27X1.27MM: Part Description: 1.27mm x 1.27mm PCB Copper Area (SMD Test Point); Mounted: No; Part Number: SMD_PAD_1.27X1.27MM; Component Kind: Standard (No BOM); Component Type: Standard (No BOM); Pin Count: 1; Family: Test Point; Socket: No; SMD: Yes; Sense: No; Status: None; ComponentHeight: 0mm; HelpURL: Undefined; Author: CERN DEM JLC; CreateDate: 12.01.2008; LatestRevisionDate: 12.01.2008; PackageDescription: 1.27mm x 1.27mm PCB Copper Area (SMD Test Point)
W11 = SAMTEC_MTLW-104-07-L-S-250: 4 Mini Wire-Wrap Contact Strip Header; Manufacturer: SAMTEC; Part Description: 4 Contacts, Pitch 2.54mm, Single Row Through Mount Straight Header (Post Lead = 6.35mm, Tail Lead 3.05mm, Insulator 1.52mm); PressFit: No; Manufacturer Part Number: MTLW-104-07-L-S-250; Part Number: SAMTEC_MTLW-104-07-L-S-250; Component Kind: Standard; Component Type: Standard; Pin Count: 4; Family: Header 4; Mounted: Yes; Socket: No; Sense: No; SMD: No; Status: None; ComponentHeight: 7.87mm; HelpURL: \\cern.ch\dfs\Applications\Altium\Datasheets\SAMTEC_MTLW-104-07-L-S-250.pdf; Author: CERN DEM JLC; CreateDate: 13.12.2012; LatestRevisionDate: 13.12.2012

## Sheet QUAD_BUCK.SchDoc: Sayma AMC
size 420 x 297 mm; CheckedBy: P.Kulik,T.Przywozki,W.Ruclo; Author: G.Kasprowicz; CompanyName: WUT ISE; DrawnBy: G.Kasprowicz; Organization: WUT ISE; Address1: PW ISE; Address2: Nowowiejska 15/19 00-665 Warsaw; Address3: gkasprow@gmail.com; DocumentNumber: 15; Revision: 2; SheetNumber: 15; SheetTotal: 32; ModifiedBy: -; CheckedDate: -; Title2: Quad buck converter; DivGrp: WUT ISE; Designer: G.Kasprowicz; ModifiedDate: -; ProjectName: Sensor Box
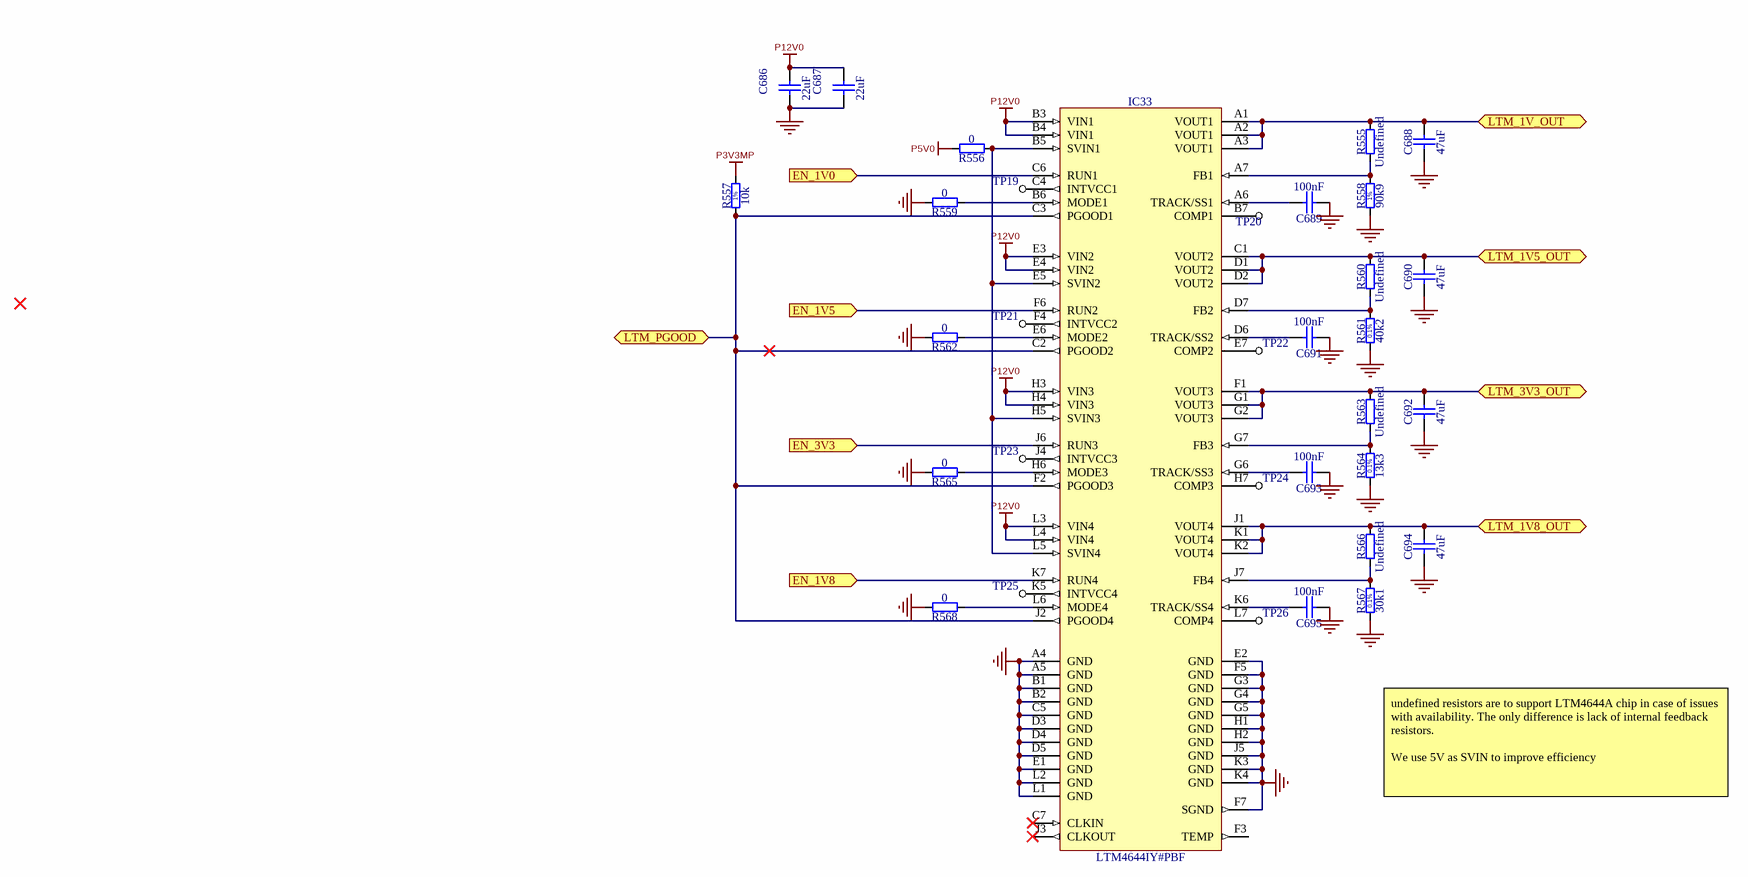
[diagram p9: QUAD_BUCK.SchDoc]

### Parts
C686  22uF  [CAPC2012X135N]
C687  22uF  [CAPC2012X135N]
C688  47uF  [CAPC2012X140N]
C689  100nF  [CAPC1005X55N]
C690  47uF  [CAPC2012X140N]
C691  100nF  [CAPC1005X55N]
C692  47uF  [CAPC2012X140N]
C693  100nF  [CAPC1005X55N]
C694  47uF  [CAPC2012X140N]
C695  100nF  [CAPC1005X55N]
IC33  LTM4644IY#PBF  [BGA77C127P7X11_900X1500X521]
R555  Undefined  [RESC1608X55N]
R556  0  [RESC1005X40N]
R557  10k  [RESC1005X40N]
R558  90k9  [RESC1608X55N]
R559  0  [RESC1005X40N]
R560  Undefined  [RESC1608X55N]
R561  40k2  [RESC1608X55N]
R562  0  [RESC1005X40N]
R563  Undefined  [RESC1608X55N]
R564  13k3  [RESC1608X55N]
R565  0  [RESC1005X40N]
R566  Undefined  [RESC1608X55N]
R567  30k1  [RESC1608X55N]
R568  0  [RESC1005X40N]
TP19  TP  [TP]  (value not drawn)
TP20  TP  [TP]  (value not drawn)
TP21  TP  [TP]  (value not drawn)
TP22  TP  [TP]  (value not drawn)
TP23  TP  [TP]  (value not drawn)
TP24  TP  [TP]  (value not drawn)
TP25  TP  [TP]  (value not drawn)
TP26  TP  [TP]  (value not drawn)

### Ports
EN_1V0 (in), EN_1V5 (in), EN_1V8 (in), EN_3V3 (in), LTM_1V5_OUT (bidir), LTM_1V8_OUT (bidir), LTM_1V_OUT (bidir), LTM_3V3_OUT (bidir), LTM_PGOOD (bidir)

### Nets
GND: C686.1 C687.1 C688.1 C689.1 C690.1 C691.1 C692.1 C693.1 C694.1 C695.1 IC33.A4(GND) IC33.A5(GND) IC33.B1(GND) IC33.B2(GND) IC33.C5(GND) IC33.D3(GND) IC33.D4(GND) IC33.D5(GND) IC33.E1(GND) IC33.E2(GND) IC33.F5(GND) IC33.F7(SGND) IC33.G3(GND) IC33.G4(GND) IC33.G5(GND) IC33.H1(GND) IC33.H2(GND) IC33.J5(GND) IC33.K3(GND) IC33.K4(GND) IC33.L1(GND) IC33.L2(GND) R558.1 R559.2 R561.1 R562.2 R564.1 R565.2 R567.1 R568.2
P3V3MP: R557.2
P5V0: R556.2
P12V0: C686.2 C687.2 IC33.B3(VIN1) IC33.B4(VIN1) IC33.E3(VIN2) IC33.E4(VIN2) IC33.H3(VIN3) IC33.H4(VIN3) IC33.L3(VIN4) IC33.L4(VIN4)
EN_1V0: IC33.C6(RUN1) ; port EN_1V0
EN_1V5: IC33.F6(RUN2) ; port EN_1V5
EN_1V8: IC33.K7(RUN4) ; port EN_1V8
EN_3V3: IC33.J6(RUN3) ; port EN_3V3
LTM_1V5_OUT: C690.2 IC33.C1(VOUT2) IC33.D1(VOUT2) IC33.D2(VOUT2) R560.2 ; port LTM_1V5_OUT
LTM_1V8_OUT: C694.2 IC33.J1(VOUT4) IC33.K1(VOUT4) IC33.K2(VOUT4) R566.2 ; port LTM_1V8_OUT
LTM_1V_OUT: C688.2 IC33.A1(VOUT1) IC33.A2(VOUT1) IC33.A3(VOUT1) R555.2 ; port LTM_1V_OUT
LTM_3V3_OUT: C692.2 IC33.F1(VOUT3) IC33.G1(VOUT3) IC33.G2(VOUT3) R563.2 ; port LTM_3V3_OUT
LTM_PGOOD: IC33.C2(PGOOD2) IC33.C3(PGOOD1) IC33.F2(PGOOD3) IC33.J2(PGOOD4) R557.1 ; port LTM_PGOOD
NetC689_2: C689.2 IC33.A6(TRACK/SS1)
NetC691_2: C691.2 IC33.D6(TRACK/SS2)
NetC693_2: C693.2 IC33.G6(TRACK/SS3)
NetC695_2: C695.2 IC33.K6(TRACK/SS4)
NetIC33_A7: IC33.A7(FB1) R555.1 R558.2
NetIC33_B5: IC33.B5(SVIN1) IC33.E5(SVIN2) IC33.H5(SVIN3) IC33.L5(SVIN4) R556.1
NetIC33_B6: IC33.B6(MODE1) R559.1
NetIC33_B7: IC33.B7(COMP1) TP20.1
NetIC33_C4: IC33.C4(INTVCC1) TP19.1
NetIC33_D7: IC33.D7(FB2) R560.1 R561.2
NetIC33_E6: IC33.E6(MODE2) R562.1
NetIC33_E7: IC33.E7(COMP2) TP22.1
NetIC33_F4: IC33.F4(INTVCC2) TP21.1
NetIC33_G7: IC33.G7(FB3) R563.1 R564.2
NetIC33_H6: IC33.H6(MODE3) R565.1
NetIC33_H7: IC33.H7(COMP3) TP24.1
NetIC33_J4: IC33.J4(INTVCC3) TP23.1
NetIC33_J7: IC33.J7(FB4) R566.1 R567.2
NetIC33_K5: IC33.K5(INTVCC4) TP25.1
NetIC33_L6: IC33.L6(MODE4) R568.1
NetIC33_L7: IC33.L7(COMP4) TP26.1

Not connected (* = marked no-connect by the designer): IC33 C7(CLKIN)* F3(TEMP) J3(CLKOUT)*

### Notes on the sheet
- undefined resistors are to support LTM4644A chip in case of issues with availability. The only difference is lack of internal feedback resistors.
  We use 5V as SVIN to improve efficiency
- Project/Equipment
- Document
- Designer
- Drawn by
- Check.by
- Copyright WUT ISE 2018.
  This documentation describes Open Hardware and is licensed under the CERN OHL v.1.1. You may redistribute and modify this documentation under the terms of the CERN OHL v.1.1. (http://ohwr.org/CERNOHL). This documentation is distributed WITHOUT ANY EXPRESS OR IMPLIED WARRANTY, INCLUDING OF MERCHANTABILITY, SATISFACTORY QUALITY AND FITNESS FOR A PARTICULAR PURPOSE. Please see the CERN OHL v.1.1 for applicable conditions.
- Contact
- File
- Last Mod.
- Print Date
- Sheet
- Size
- A3
- of
- Rev
- (in symbol R0402_10K_1%_0.0625W_100PPM) 1%
- (in symbol R0603_13K3_0.1%_0.063W_10PPM) 0.1%
- (in symbol R0603_30K1_0.1%_0.063W_10PPM) 0.1%
- (in symbol R0603_40K2_0.1%_0.063W_10PPM) 0.1%
- (in symbol R0603_90K9_1%_0.1W_100PPM) 1%

### Library data of the parts
C686 C687 = CC0805_22UF_16V_10%_X5R: as C634 on sheet POWER_Management; Manufacturer Part Number: CC0805_22UF_16V_10%_X5R; Part Number: CC0805_22UF_16V_10%_X5R; Value: 22uF; Component Kind: Standard; Component Type: Standard; Pin Count: 2; Status: Preferred; Case: 0805; Mounted: Yes; Socket: No; SMD: Yes; Sense: No; Manufacturer1 Example: TDK; Manufacturer1 ComponentHeight: 1.35mm; HelpURL: \\cern.ch\dfs\Applications\Altium\Datasheets\CC0805_X5R_TDK_C.pdf; Author: CERN DEM JLC; CreateDate: 25.10.2012; LatestRevisionDate: 25.10.2012
C688 C690 C692 C694 = CC0805_47UF_6.3V_20%_X5R: Non-polarised capacitor; Manufacturer: GENERIC; Part Description: SMD Multilayer Chip Ceramic Capacitor; Manufacturer1 Part Number: C0805C476M9PACTU; Tolerance: ±20%; Voltage: 6.3V; TC: X5R; Manufacturer Part Number: CC0805_47UF_6.3V_20%_X5R; Part Number: CC0805_47UF_6.3V_20%_X5R; Value: 47uF; Component Kind: Standard; Component Type: Standard; Pin Count: 2; Status: Preferred; Case: 0805; Mounted: Yes; Socket: No; SMD: Yes; Sense: No; Manufacturer1 Example: KEMET; Manufacturer1 ComponentHeight: 1.4mm; HelpURL: \\cern.ch\dfs\Applications\Altium\Datasheets\CC0805_X5R_KEMET.pdf; Author: CERN DEM JLC; CreateDate: 16.10.2012; LatestRevisionDate: 16.10.2012
C689 C691 C693 C695 = CC0402_100NF_16V_10%_X5R: as C93 on sheet PWR_DC_DC_EXAR; Part Number: CC0402_100NF_16V_10%_X5R; Component Kind: Standard; Component Type: Standard; Pin Count: 2; Value: 100nF; Status: None; Manufacturer Part Number: CC0402_100NF_16V_10%_X5R; Case: 0402; Mounted: Yes; Socket: No; SMD: Yes; Sense: No; Manufacturer1 Example: MURATA; Manufacturer1 ComponentHeight: 0.55mm; HelpURL: \\cern.ch\dfs\Applications\Altium\Datasheets\CC0402_X5R_MURATA_GRM.pdf; Author: CERN DEM JLC; CreateDate: 10.12.2013; LatestRevisionDate: 10.12.2013
IC33 = LTM4644IY#PBF: Quad DC/DC µModule Regulator with Configurable 4A Output Array; Part Description: 4V-14V to 0.6V-5.5V Quad DC/DC uModule (Power Module) Regulator with Configurable 4A Output Array; Manufacturer: LINEAR TECHNOLOGY; PressFit: No; Bonding: No; Part Number: LTM4644IY#PBF; Component Kind: Standard; Component Type: Standard; Device: LTM4644IY#PBF; PackageDescription: BGA, 1.27mm Pitch, Rect.; 77 Pin, 7 Columns X 11 Rows, 9.00mm X 15.00mm X 5.21mm H; Manufacturer Part Number: LTM4644IY#PBF; Pin Count: 77; Case: BGA77; Mounted: Yes; Socket: No; SMD: Yes; Sense: No; ComponentHeight: 5.21mm; HelpURL: \\cern.ch\dfs\Applications\Altium\Datasheets\LTM4644IY#PBF.pdf; Author: CERN DEM JLC; CreateDate: 25.04.2018; LatestRevisionDate: 25.04.2018
R555 R560 R563 R566 = R0603_NO-VALUE: Resistor; Part Description: Reserved Footprint For a 0603 (1608) Chip Resistor; PressFit: No; Mounted: No; Part Number: R0603_NO-VALUE; Component Kind: Standard; Component Type: Standard; Pin Count: 2; Value: Undefined; Status: None; Manufacturer: Undefined; Manufacturer Part Number: R0603_NO-VALUE; Case: 0603; Sense: No; Socket: No; SMD: Yes; Manufacturer1 Example: Undefined; Manufacturer1 Part Number: Undefined; Manufacturer1 ComponentHeight: Undefined; HelpURL: Undefined; Author: CERN DEM JLC; CreateDate: 03.12.2007; LatestRevisionDate: 13.03.2008
R556 R559 R562 R565 R568 = R0402_0R_JUMPER: Resistor; Manufacturer: GENERIC; Part Description: 1A (0.05R Max DC Resistance) Zero Ohm Jumper; Manufacturer1 Part Number: 232270591001L; PressFit: No; Manufacturer Part Number: R0402_0R_JUMPER; Part Number: R0402_0R_JUMPER; Value: 0; Component Kind: Standard; Component Type: Standard; Pin Count: 2; Status: Not Recommended; Case: 0402; Mounted: Yes; Sense: No; Socket: No; SMD: Yes; Manufacturer1 Example: YAGEO PHYCOMP; Manufacturer1 ComponentHeight: 0.4mm; HelpURL: \\cern.ch\dfs\Applications\Altium\Datasheets\R0402_Phycomp_RC0402.pdf; Author: CERN DEM JLC; CreateDate: 03.12.2007; LatestRevisionDate: 17.10.2012
R557 = R0402_10K_1%_0.0625W_100PPM: as R139 on sheet SDRAM_DDR3_2x16; Manufacturer Part Number: R0402_10K_1%_0.0625W_100PPM; Part Number: R0402_10K_1%_0.0625W_100PPM; Tolerance: ±1%; Value: 10k; Component Kind: Standard; Component Type: Standard; Pin Count: 2; Status: Not Recommended; Power: 0.0625W; Case: 0402; Mounted: Yes; Sense: No; Socket: No; SMD: Yes; Manufacturer1 Example: YAGEO PHYCOMP; Manufacturer1 ComponentHeight: 0.4mm; HelpURL: \\cern.ch\dfs\Applications\Altium\Datasheets\R0402_Phycomp_RC0402.pdf; Author: CERN DEM JLC; CreateDate: 03.12.2007; LatestRevisionDate: 17.10.2012
R558 = R0603_90K9_1%_0.1W_100PPM: Resistor - 1%; Part Description: General Purpose Thick Film Chip Resistor; Manufacturer: GENERIC; Manufacturer1 Part Number: CRCW060390K9FKEA; Power: 0.1W; TC: ±100ppm/°C; PressFit: No; Part Number: R0603_90K9_1%_0.1W_100PPM; Component Kind: Standard; Component Type: Standard; Pin Count: 2; Value: 90k9; Status: Preferred; Tolerance: ±1%; Manufacturer Part Number: R0603_90K9_1%_0.1W_100PPM; Case: 0603; Mounted: Yes; Sense: No; Socket: No; SMD: Yes; Manufacturer1 Example: VISHAY; Manufacturer1 ComponentHeight: 0.55mm; HelpURL: \\cern.ch\dfs\Applications\Altium\Datasheets\R0603_VISHAY_CRCW e3.pdf; Author: CERN DEM JLC; CreateDate: 14.03.2018; LatestRevisionDate: 14.03.2018
R561 = R0603_40K2_0.1%_0.063W_10PPM: Resistor - 0.1%; Part Description: Thin Film Chip Resistor; Manufacturer: GENERIC; Manufacturer1 Part Number: RN73C1J40K2BTDF; Power: 0.063W; TC: ±10ppm; PressFit: No; Part Number: R0603_40K2_0.1%_0.063W_10PPM; Component Kind: Standard; Component Type: Standard; Pin Count: 2; Value: 40k2; Status: Not Recommended; Tolerance: ±0.1%; Manufacturer Part Number: R0603_40K2_0.1%_0.063W_10PPM; Case: 0603; Mounted: Yes; Sense: No; Socket: No; SMD: Yes; Manufacturer1 Example: TYCO HOLSWORTHY; Manufacturer1 ComponentHeight: 0.5mm; HelpURL: \\cern.ch\dfs\Applications\Altium\Datasheets\R0603_Tyco_RN73.pdf; Author: CERN DEM JLC; CreateDate: 03.12.2007; LatestRevisionDate: 13.03.2008
R564 = R0603_13K3_0.1%_0.063W_10PPM: Resistor - 0.1%; Part Description: Thin Film Chip Resistor; Manufacturer: GENERIC; Manufacturer1 Part Number: RN73C1J13K3BTDF; Power: 0.063W; TC: ±10ppm; PressFit: No; Part Number: R0603_13K3_0.1%_0.063W_10PPM; Component Kind: Standard; Component Type: Standard; Pin Count: 2; Value: 13k3; Status: Not Recommended; Tolerance: ±0.1%; Manufacturer Part Number: R0603_13K3_0.1%_0.063W_10PPM; Case: 0603; Mounted: Yes; Sense: No; Socket: No; SMD: Yes; Manufacturer1 Example: TYCO HOLSWORTHY; Manufacturer1 ComponentHeight: 0.5mm; HelpURL: \\cern.ch\dfs\Applications\Altium\Datasheets\R0603_Tyco_RN73.pdf; Author: CERN DEM JLC; CreateDate: 03.12.2007; LatestRevisionDate: 13.03.2008
R567 = R0603_30K1_0.1%_0.063W_10PPM: Resistor - 0.1%; Part Description: Thin Film Chip Resistor; Manufacturer: GENERIC; Manufacturer1 Part Number: RN73C1J30K1BTDF; Power: 0.063W; TC: ±10ppm; PressFit: No; Part Number: R0603_30K1_0.1%_0.063W_10PPM; Component Kind: Standard; Component Type: Standard; Pin Count: 2; Value: 30k1; Status: Not Recommended; Tolerance: ±0.1%; Manufacturer Part Number: R0603_30K1_0.1%_0.063W_10PPM; Case: 0603; Mounted: Yes; Sense: No; Socket: No; SMD: Yes; Manufacturer1 Example: TYCO HOLSWORTHY; Manufacturer1 ComponentHeight: 0.5mm; HelpURL: \\cern.ch\dfs\Applications\Altium\Datasheets\R0603_Tyco_RN73.pdf; Author: CERN DEM JLC; CreateDate: 03.12.2007; LatestRevisionDate: 13.03.2008
TP19-TP26 = TP: Testpoint